# Altium schematic sheet 03-POWER.SchDoc
size A2; Customer: 01910; SPICEModelCache: <root> / <DocumentId>GNEMVTBT</DocumentId> / <CacheFrame Number="0"> / <Model Name="emk105bj105_v-f" Kind="CKT"> / <Text>* EMK105BJ105_V-F     SPICE MODEL  ( General Type ) / *-------------------------------------------------------------------------------------------------------- / * Model Generated by TAIYO YUDEN Corporation (http://www.ty-top.com) / * Version 1.0 / * TAIYO YUDEN Control No. 170508_130520 / * Copyright(c) 2012 TAIYO YUDEN CO.,LTD. All Rights Reserved. / *-------------------------------------------------------------------------------------------------------- / * / * Products Name : Multilayer Ceramic Capacitors / * / * Characteristics : / *     Capacitance : 1 uF , Rated Voltage : 16V , TCC : X5R / *     Case Size : 1.0 x 0.5 / 0.039 x 0.02 [mm/inch] , Thickness : 0.5 / 0.02 [mm/inch] / *     (Conditions: Temperature = 25 degC , DC Bias Current/Voltage = 0A / 0V) / * / * Frequency Range : 40Hz - 3GHz / * / * External Node Assignments : / * / *  1  o---| |---o  2 / * / *-------------------------------------------------------------------------------------------------------- / .SubCkt EMK105BJ105_V-F 1 2 / **************************** / C0 1 110 0.68309u / Cm 1 101 0.26053u / C1 101 102 0.94076u / Rc1 101 102 1.9029k / C2 102 103 0.66707u / Rc2 102 103 120.36 / C3 103 110 0.57203u / Rc3 103 110 2.1097 / C2m 1 301 0.1871u / C21 301 302 3.2494u / Rc21 301 302 1.1117k / C22 302 303 2.1014u / Rc22 302 303 1.484k / C23 303 304 2.1172u / Rc23 303 304 1.3876k / C24 304 305 0.75729u / Rc24 304 305 332.59 / C25 305 306 0.94401u / Rc25 305 306 249.09 / C26 306 307 0.34674u / Rc26 306 307 28.352 / C27 307 308 0.37158u / Rc27 307 308 19.989 / C28 308 309 0.17933u / Rc28 308 309 31.748 / C29 309 110 0.016445u / Rc29 309 110 1.0592 / Rp0 1 110 100Meg / L0 110 120 0.2216n / Lm 120 130 0.1509n / L1 120 121 0.12659n / RL1 121 130 0.85161 / L2 120 122 0.15996n / RL2 122 130 0.42469 / L3 120 123 7.9543n / RL3 123 130 0.54643m / CR 120 124 0.24334u / LR 124 125 0.090738n / RR 125 130 68.076m / CL 130 140 2.7354p / LL 130 140 0.10762n / RL 130 140 50.614 / Rs 140 2 7.5416m / **************************** / .ends EMK105BJ105_V-F</Text> / </Model> / </CacheFrame> / </root>
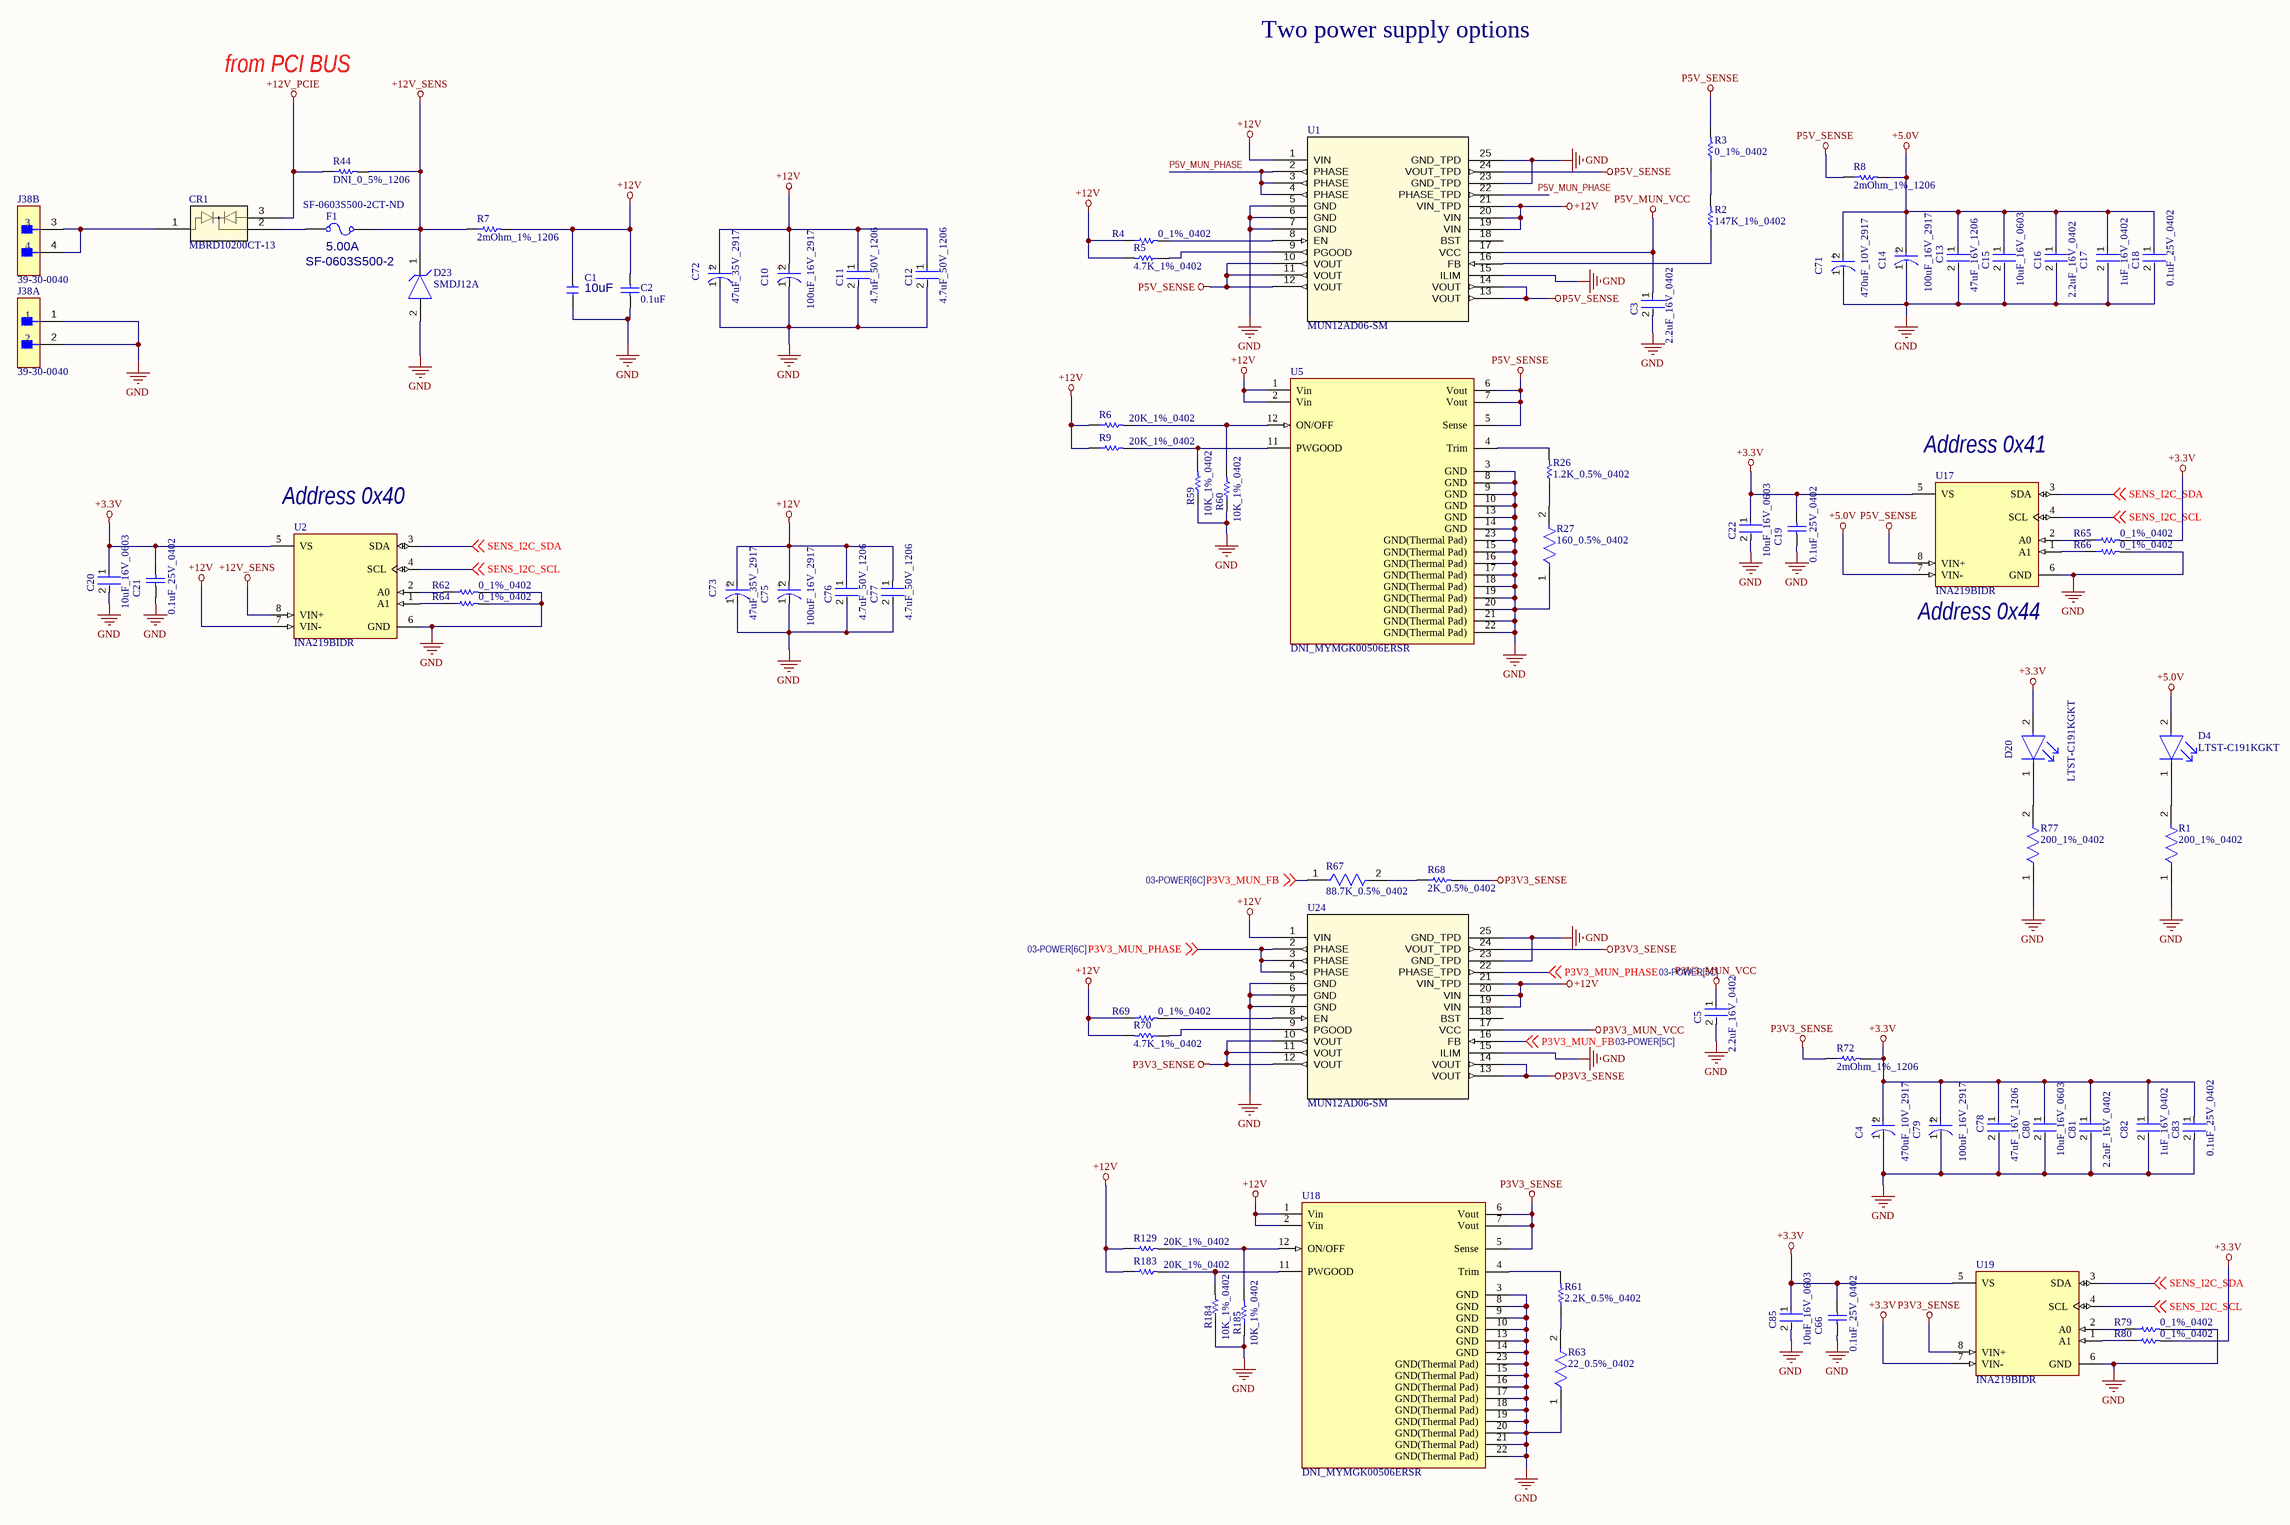
[diagram p0: 03-POWER.SchDoc]

## Parts
C1  value 10uF  [CAPC2012X14N]  (hidden comment: CAP_0805_10UF_25V)
C2  0.1uF  [CAPC1608X87X45ML20T05]
C3  2.2uF_16V_0402  [FP-C1005-050-0_05-IPC_A]
C4  470uF_10V_2917  [FP-TAJE-MFG]
C5  2.2uF_16V_0402  [FP-C1005-050-0_05-IPC_A]
C10  100uF_16V_2917  [FP-T495D107K016ATE125-MFG]
C11  4.7uF_50V_1206  [FP-GRM31C-0_2-e0_3_0_8-IPC_C]
C12  4.7uF_50V_1206  [FP-GRM31C-0_2-e0_3_0_8-IPC_C]
C13  47uF_16V_1206  [FP-C3216-160-0_2-MFG]
C14  100uF_16V_2917  [FP-T495D107K016ATE125-MFG]
C15  10uF_16V_0603  [FP-0603-L_1_6_0_2-W_0_8_0-MFG]
C16  2.2uF_16V_0402  [FP-C1005-050-0_05-IPC_A]
C17  1uF_16V_0402  [FP-0402-L_1_0_0_05-W_0_5-IPC_A]
C18  0.1uF_25V_0402  [FP-0402-L_1_0_1-W_0_5_0_1-IPC_C]
C19  0.1uF_25V_0402  [CAPC1005X56X25NL10T15]
C20  10uF_16V_0603  [FP-0603-L_1_6_0_2-W_0_8_0-MFG]
C21  0.1uF_25V_0402  [CAPC1005X56X25NL10T15]
C22  10uF_16V_0603  [FP-0603-L_1_6_0_2-W_0_8_0-MFG]
C66  0.1uF_25V_0402  [CAPC1005X56X25NL10T15]
C71  470uF_10V_2917  [FP-TAJE-MFG]
C72  47uF_35V_2917  [FP-T521X476M035ATE030-MFG]
C73  47uF_35V_2917  [FP-T521X476M035ATE030-MFG]
C75  100uF_16V_2917  [FP-T495D107K016ATE125-MFG]
C76  4.7uF_50V_1206  [FP-GRM31C-0_2-e0_3_0_8-IPC_C]
C77  4.7uF_50V_1206  [FP-GRM31C-0_2-e0_3_0_8-IPC_C]
C78  47uF_16V_1206  [FP-C3216-160-0_2-MFG]
C79  100uF_16V_2917  [FP-T495D107K016ATE125-MFG]
C80  10uF_16V_0603  [FP-0603-L_1_6_0_2-W_0_8_0-MFG]
C81  2.2uF_16V_0402  [FP-C1005-050-0_05-IPC_A]
C82  1uF_16V_0402  [FP-0402-L_1_0_0_05-W_0_5-IPC_A]
C83  0.1uF_25V_0402  [FP-0402-L_1_0_1-W_0_5_0_1-IPC_C]
C85  10uF_16V_0603  [FP-0603-L_1_6_0_2-W_0_8_0-MFG]
CR1  MBRD10200CT-13  [TO252(DPAK)_DIO]
D4  LTST-C191KGKT  [FP-LTST-C191KGKT-MFG]
D20  LTST-C191KGKT  [FP-LTST-C191KGKT-MFG]
D23  SMDJ12A  [FP-DO-214AB_SMC_J-Bend-MFG]
F1  value 5.00A  MFG PART NUM: SF-0603S500-2  Supplier Part Number 1: SF-0603S500-2CT-ND  [FUSM1608X60N]  (hidden comment: FUSE_0603_5.00A)
J38  39-30-0040  [FP-39-30-0040-MFG]  (parts A,B of 2)
R1  200_1%_0402  [FP-ERJ2RK-IPC_A]
R2  147K_1%_0402  [RESC1005X40X25ML05T10]
R3  0_1%_0402  [RESC1005X40X25LL05T05]
R4  0_1%_0402  [RESC1005X40X25LL05T05]
R5  4.7K_1%_0402  [RESC1005X40X25NL10T10]
R6  20K_1%_0402  [RESC1005X40X25NL10T10]
R7  2mOhm_1%_1206  [RESC3216X89X64NL25T25]
R8  2mOhm_1%_1206  [RESC3216X89X64NL25T25]
R9  20K_1%_0402  [RESC1005X40X25NL10T10]
R26  1.2K_0.5%_0402  [RESC1005X40X25ML10T10]
R27  160_0.5%_0402  [FP-RT0402-MFG]
R44  DNI_0_5%_1206  [RESC3116X65X50ML20T20]  (no BOM)
R59  10K_1%_0402  [RESC1005X40X25NL10T10]
R60  10K_1%_0402  [RESC1005X40X25NL10T10]
R61  2.2K_0.5%_0402  [RESC1005X40X25ML10T10]
R62  0_1%_0402  [RESC1005X40X25LL05T05]
R63  22_0.5%_0402  [FP-RG1005-IPC_A]
R64  0_1%_0402  [RESC1005X40X25LL05T05]
R65  0_1%_0402  [RESC1005X40X25LL05T05]
R66  0_1%_0402  [RESC1005X40X25LL05T05]
R67  88.7K_0.5%_0402  [FP-RT0402-MFG]
R68  2K_0.5%_0402  [RESC1005X35X25LL10T10]
R69  0_1%_0402  [RESC1005X40X25LL05T05]
R70  4.7K_1%_0402  [RESC1005X40X25NL10T10]
R72  2mOhm_1%_1206  [RESC3216X89X64NL25T25]
R77  200_1%_0402  [FP-ERJ2RK-IPC_A]
R79  0_1%_0402  [RESC1005X40X25LL05T05]
R80  0_1%_0402  [RESC1005X40X25LL05T05]
R129  20K_1%_0402  [RESC1005X40X25NL10T10]
R183  20K_1%_0402  [RESC1005X40X25NL10T10]
R184  10K_1%_0402  [RESC1005X40X25NL10T10]
R185  10K_1%_0402  [RESC1005X40X25NL10T10]
U1  MUN12AD06-SM  [MUN12AD06-SM_CYN]
U2  INA219BIDR  [FP-D0008A-MFG]
U5  DNI_MYMGK00506ERSR  [FP-MYMGK-12-MFG]  (no BOM)
U17  INA219BIDR  [FP-D0008A-MFG]
U18  DNI_MYMGK00506ERSR  [FP-MYMGK-12-MFG]  (no BOM)
U19  INA219BIDR  [FP-D0008A-MFG]
U24  MUN12AD06-SM  [MUN12AD06-SM_CYN]

## Nets
+3.3V: C4.2(A) C19.2 C20.1 C21.2 C22.1 C66.2 C78.1 C79.2(A) C80.1 C81.1 C82.1 C83.1 C85.1 D20.2(A) R65.2 R72.2 R80.2 U2.5(VS) U17.5(VS) U19.5(VS) U19.7(VIN-)
+5.0V: C13.1 C14.2(A) C15.1 C16.1 C17.1 C18.1 C71.2(A) D4.2(A) R8.2 U17.7(VIN-)
+12V: C1.1 C2.2 C10.2(A) C11.1 C12.1 C72.2(A) C73.2(A) C75.2(A) C76.1 C77.1 R4.1 R5.2 R6.1 R7.2 R9.1 R69.1 R70.2 R129.1 R183.1 U1.1(VIN) U1.19(VIN) U1.20(VIN) U1.21(VIN_TPD) U2.7(VIN-) U5.1(Vin) U5.2(Vin) U18.1(Vin) U18.2(Vin) U24.1(VIN) U24.19(VIN) U24.20(VIN) U24.21(VIN_TPD)
+12V_PCIE: CR1.3 R44.1
+12V_SENS: D23.1(C) F1.2 R7.1 R44.2 U2.8(VIN+)
GND: C1.2 C2.1 C3.2 C4.1(C) C5.2 C10.1(C) C11.2 C12.2 C13.2 C14.1(C) C15.2 C16.2 C17.2 C18.2 C19.1 C20.2 C21.1 C22.2 C66.1 C71.1(C) C72.1(C) C73.1(C) C75.1(C) C76.2 C77.2 C78.2 C79.1(C) C80.2 C81.2 C82.2 C83.2 C85.2 D23.2(A) J38.1 J38.2 R1.1 R27.1 R59.1 R60.1 R62.2 R63.1 R64.2 R66.2 R77.1 R79.2 R184.1 R185.1 U1.5(GND) U1.6(GND) U1.7(GND) U1.15(ILIM) U1.23(GND_TPD) U1.25(GND_TPD) U2.6(GND) U5.3(GND) U5.8(GND) U5.9(GND) U5.10(GND) U5.13(GND) U5.14(GND) U5.15(GND(Thermal_Pad)) U5.16(GND(Thermal_Pad)) U5.17(GND(Thermal_Pad)) U5.18(GND(Thermal_Pad)) U5.19(GND(Thermal_Pad)) U5.20(GND(Thermal_Pad)) U5.21(GND(Thermal_Pad)) U5.22(GND(Thermal_Pad)) U5.23(GND(Thermal_Pad)) U17.6(GND) U18.3(GND) U18.8(GND) U18.9(GND) U18.10(GND) U18.13(GND) U18.14(GND) U18.15(GND(Thermal_Pad)) U18.16(GND(Thermal_Pad)) U18.17(GND(Thermal_Pad)) U18.18(GND(Thermal_Pad)) U18.19(GND(Thermal_Pad)) U18.20(GND(Thermal_Pad)) U18.21(GND(Thermal_Pad)) U18.22(GND(Thermal_Pad)) U18.23(GND(Thermal_Pad)) U19.6(GND) U24.5(GND) U24.6(GND) U24.7(GND) U24.15(ILIM) U24.23(GND_TPD) U24.25(GND_TPD)
P3V3_MUN_VCC: C5.1 U24.17(VCC)
P3V3_SENSE: R68.2 R72.1 U18.5(Sense) U18.6(Vout) U18.7(Vout) U19.8(VIN+) U24.10(VOUT) U24.11(VOUT) U24.12(VOUT) U24.13(VOUT) U24.14(VOUT) U24.24(VOUT_TPD)
P5V_MUN_VCC: C3.1 U1.17(VCC)
P5V_SENSE: R3.2 R8.1 U1.10(VOUT) U1.11(VOUT) U1.12(VOUT) U1.13(VOUT) U1.14(VOUT) U1.24(VOUT_TPD) U5.5(Sense) U5.6(Vout) U5.7(Vout) U17.8(VIN+)
P3V3_MUN_FB: R67.1 U24.16(FB) ; off-sheet P3V3_MUN_FB
P3V3_MUN_PHASE: U24.2(PHASE) U24.3(PHASE) U24.4(PHASE) U24.22(PHASE_TPD) ; off-sheet P3V3_MUN_PHASE
P5V_MUN_PHASE: U1.2(PHASE) U1.3(PHASE) U1.4(PHASE) U1.22(PHASE_TPD)
SENS_I2C_SCL: U2.4(SCL) U17.4(SCL) U19.4(SCL) ; off-sheet SENS_I2C_SCL
SENS_I2C_SDA: U2.3(SDA) U17.3(SDA) U19.3(SDA) ; off-sheet SENS_I2C_SDA
NetCR1_1: CR1.1 J38.3 J38.4
NetCR1_2: CR1.2 F1.1
NetD4_1: D4.1(C) R1.2
NetD20_1: D20.1(C) R77.2
NetR2_1: R2.1 U1.16(FB)
NetR2_2: R2.2 R3.1
NetR4_2: R4.2 U1.8(EN)
NetR5_1: R5.1 U1.9(PGOOD)
NetR6_2: R6.2 R60.2 U5.12(ON/OFF)
NetR9_2: R9.2 R59.2 U5.11(PWGOOD)
NetR26_1: R26.1 R27.2
NetR26_2: R26.2 U5.4(Trim)
NetR61_1: R61.1 R63.2
NetR61_2: R61.2 U18.4(Trim)
NetR62_1: R62.1 U2.2(A0)
NetR64_1: R64.1 U2.1(A1)
NetR65_1: R65.1 U17.2(A0)
NetR66_1: R66.1 U17.1(A1)
NetR67_2: R67.2 R68.1
NetR69_2: R69.2 U24.8(EN)
NetR70_1: R70.1 U24.9(PGOOD)
NetR79_1: R79.1 U19.2(A0)
NetR80_1: R80.1 U19.1(A1)
NetR129_2: R129.2 R185.2 U18.12(ON/OFF)
NetR183_2: R183.2 R184.2 U18.11(PWGOOD)

Not connected (* = marked no-connect by the designer): U1 18(BST); U24 18(BST)

## Notes on the sheet
- Two power supply options
- from PCI BUS
- (near U2) Address 0x40
- (near U17) Address 0x41
- (near U17) Address 0x44
- SHEET
- REV
- timingcard.com <http://timingcard.com>
- DATE
- OF
- (in symbol CMP-2000-07207-2) +
- (in symbol CMP-03016-000019-1) +
- (in symbol CMP-04424-000243-1) +

## Library data of the parts
C1 = CAP_0805_10UF_25V: CAP, CER, 10.UF, 25V, 10%, X5R, 0805; MFG PART NUM: TMK212BBJ106KG-T; VALENTIUM PART NUM: <VALENTIUM>; MFG NAME: TAIYO YUDEN; MAXTEMP: 85C; MINTEMP: -55C; DESC: CAP, CER, 10.UF, 10V, 10%, X5R, 0805; MODIFY DATE: 10/23/2013; CATEGORY: CAP, CER; Date: 4/11/2006 3:37:28 PM; SHEETPART: *; P1: 10%; P2: 25V; P3: X5R; Size: 0805; Supplier 1: MOUSER; Supplier Part Number 1: 963-TMK212BBJ106KG-T
C2 = CMP-2006-00003-1: C0603X104K5RACAUTO; Manufacturer: Kemet; Part Number: C0603X104K5RACAUTO
C3 C5 C16 C81 = CMP-2000-05998-2: Multilayer Ceramic Capacitors 2.2μF ±10% 16V X5R SMD 0402; Capacitance: 2.2uF; REACH SVHC: No SVHC; Series: C; Termination: SMD/SMT; Case Code (Imperial): 0402; Depth: 0.5mm; Mount: Surface Mount; Width: 0.02inch; Package Quantity: 1; Dielectric Material: Ceramic; Length: 1mm; Packaging: Tape and Reel; Case Code (Metric): 1005; RoHS Compliant: Yes; Dielectric: X5R; Max Operating Temperature: 85°C; Lead Free: Lead Free; Weight: 2.3E-05oz; Thickness: 0.022inch; Voltage Rating (DC): 16V; Tolerance: 10%; Voltage Rating: 16V; Resistor Type: Ceramic; Height: 0.5mm; Case/Package: 0402; Min Operating Temperature: -55°C
C4 C71 = CMP-04424-000243-1: 470uF 10V  ±10% 500mΩ 2917  SMD Tantalum Capacitor; Leakage Current: 47uA; ESR (Equivalent Series Resistance): 500mR; Polarity: Polar; Construction: Flat; Width: 4.3mm; Mount: Surface Mount; Tolerance: 10%; Max Operating Temperature: 125°C; Min Operating Temperature: -55°C; Length: 7.3mm; Voltage: 10V; Dissipation Factor: 10%; REACH SVHC: No SVHC; Lead Free: Lead Free; Case/Package: 2917; Voltage Rating: 10V; Capacitance: 470uF; Series: TAJ; Height: 4.1mm; RoHS Compliant: Yes; Packaging: Tape and Reel; Voltage Rating (DC): 10V; Radiation Hardening: No; Dielectric Material: Tantalum; Number of Pins: 2; Depth: 4.3mm; Case Code (Metric): 7343; Case Code (Imperial): 2917; Termination: SMD/SMT; Lead Pitch: 4.4mm; Features: General Purpose; Height - Seated (Max): 0.169inch; Package Quantity: 1
C10 C14 C75 C79 = CMP-2000-07207-2: CAP TANT 100UF 10% 16V 2917; Life (Hours): 2000Hour; ESR (Equivalent Series Resistance): 125mR; Polarity: Polar; Dielectric Material: Tantalum; Dissipation Factor: 8%; Capacitance: 100uF; Radiation Hardening: No; RoHS Compliant: Yes; Length: 7.3mm; Features: General Purpose; Packaging: Tape and Reel; Package Quantity: 1; Weight: 0.023634oz; Voltage Rating: 16V; Width: 0.169inch; Case/Package: 2917; Mount: Surface Mount; Voltage: 16V; Min Operating Temperature: -55°C; Tolerance: 10%; REACH SVHC: No SVHC; Height - Seated (Max): 0.122inch; Number of Pins: 2; Construction: Flat; Depth: 4.3mm; Series: T495; Max Operating Temperature: 125°C; Failure Rate: 0.001%; Termination: SMD/SMT; Voltage Rating (DC): 16V; Case Code (Imperial): 2917; Case Code (Metric): 7343; Height: 2.8mm
C11 C12 C76 C77 = CMP-1037-04923-3: Chip Multilayer Ceramic Capacitors for General Purpose, 1206, 4.7uF, X7R, 15%, 10%, 50V; Height: 1.6mm; Voltage: 50V; Capacitance: 4.7uF; Lead Free: Lead Free; Max Operating Temperature: 125°C; Packaging: Tape and Reel; REACH SVHC: No SVHC; Voltage Rating: 50V; Mount: Surface Mount; Termination: SMD/SMT; Tolerance: 10%; Case/Package: 1206; Material: Ceramic; Depth: 1.6mm; Length: 3.2mm; Case Code (Metric): 3216; Voltage Rating (DC): 50V; Case Code (Imperial): 1206; Radiation Hardening: No; Width: 0.063inch; Thickness: 0.071inch; Package Quantity: 2000; Min Operating Temperature: -55°C; Dielectric: X7R
C13 C78 = CMP-2000-07442-2: Multilayer Ceramic Capacitors 47uF ±20% 16V X5R SMD 1206; Resistor Type: Ceramic; Width: 0.063inch; Case Code (Imperial): 1206; Radiation Hardening: No; Thickness: 0.071inch; Dielectric: X5R; Weight: 0.000571oz; Termination: SMD/SMT; Dielectric Material: Ceramic; Min Operating Temperature: -55°C; Depth: 1.6mm; Case Code (Metric): 3216; Max Operating Temperature: 85°C; RoHS Compliant: Yes; REACH SVHC: No SVHC; Mount: Surface Mount; Lead Free: Lead Free; Height: 1.6mm; Length: 3.2mm; Tolerance: 20%; Voltage Rating (DC): 16V; Capacitance: 47uF; Package Quantity: 1; Construction: Flat; Packaging: Tape and Reel; Series: C; Case/Package: 1206; Voltage Rating: 16V
C15 C20 C22 C80 C85 = CMP-2000-06226-4: Multilayer Ceramic Capacitor 10uF 16V X5R 20% SMD 0603 T/R; Packaging: Tape and Reel; Construction: Flat; Height: 0.8mm; Max Operating Temperature: 85°C; Dielectric: X5R; Case Code (Metric): 1608; Voltage Rating (DC): 16V; Width: 0.031inch; Voltage Rating: 16V; Length: 0.063inch; RoHS Compliant: Yes; Halogen Free: Halogen Free; Case Code (Imperial): 0603; Capacitance: 10uF; Mount: Surface Mount; Thickness: 0.031inch; Tolerance: 20%; Min Operating Temperature: -55°C; Series: M; Termination: SMD/SMT; Case/Package: 0603; Package Quantity: 1
C17 C82 = CMP-14477-000104-2: None; Tolerance: 10%; Voltage Rating: 16V; Dielectric: X5R; Capacitance: 1uF; Packaging: Tape and Reel; Depth: 0.5mm; Mount: Surface Mount; Thickness: 0.022inch; Package Quantity: 1; Min Operating Temperature: -55°C; Series: M; Voltage Rating (DC): 16V; Termination: SMD/SMT; Case/Package: 0402; Number of Pins: 2; Case Code (Imperial): 0402; Length: 1mm; Halogen Free: Halogen Free; Case Code (Metric): 1005; Width: 0.02inch; RoHS Compliant: Yes; Radiation Hardening: No; Max Operating Temperature: 85°C; Height: 0.5mm; Construction: Flat
C18 C83 = CMP-2008-02519-2: General Purpose Ceramic Capacitor, 0402, 100nF, 10%, X7R, 15%, 25V; Package Quantity: 1; Capacitance: 100nF; Min Operating Temperature: -55°C; Voltage: 25V; Voltage Rating: 25V; Construction: Flat; Max Operating Temperature: 125°C; Radiation Hardening: No; Depth: 0.5mm; Thickness: 0.022inch; Voltage Rating (DC): 25V; Number of Pins: 2; Lead Free: Lead Free; Series: -; REACH SVHC: No SVHC; Length: 1mm; Dielectric: X7R; RoHS Compliant: Yes; Mount: Surface Mount; Packaging: Tape and Reel; Case/Package: 0402; Case Code (Imperial): 0402; Termination: SMD/SMT; Width: 0.02inch; Case Code (Metric): 1005; Tolerance: 10%
C19 C21 C66 = CMP-1034-02072-2: Part Number: 04023D104KAT2A; Manufacturer: AVX Interconnect / Elco
C72 C73 = CMP-03016-000019-1: CAP TANT POLY 47UF 35V 2917; Tolerance: 20%; Dissipation Factor: 10%; Life (Hours): 2000Hour; Polarity: Polar; ESR (Equivalent Series Resistance): 30mR; Mount: Surface Mount; Voltage Rating (DC): 35V; Height - Seated (Max): 0.169inch; Package Quantity: 1; Height: 4mm; Max Operating Temperature: 125°C; Width: 4.3mm; Packaging: Tape and Reel; Case/Package: 2917; Series: KO-CAP T521; Min Operating Temperature: -55°C; Depth: 4.3mm; Case Code (Metric): 7343; Number of Pins: 2; RoHS Compliant: Yes; Case Code (Imperial): 2917; Capacitance: 47uF; REACH SVHC: No SVHC; Features: General Purpose; Termination: SMD/SMT; Length: 7.3mm; Voltage Rating: 35V; Construction: Flat
CR1 = MBRD10200CT-13: No Description Available; Mfr_Name: Diodes Inc; Type: Diodes - Rectifiers, Arrays; RefDes: RefDes
D4 D20 = CMP-2000-05198-2: LED GREEN CLEAR SMD; Max Power Dissipation: 75mW; Forward Current: 30mA; Reverse Voltage: 5V; Lens Color: Colorless; Forward Voltage: 2V; Dominant Wavelength: 571nm; Number of LEDs: 1; Viewing Angle: 130°; Lens Style: Rectangular; Test Current: 20mA; Luminous Intensity: 35mcd; Wavelength: 574nm; Width: 0.8mm; Case Code (Imperial): 0603; Number of Pins: 2; Lead Free: Lead Free; Packaging: Tape and Reel; Package Quantity: 1; Min Operating Temperature: -55°C; Case/Package: 0603; Length: 1.6mm; Power Dissipation: 75mW; Depth: 0.8mm; Radiation Hardening: No; Mount: Surface Mount; Max Operating Temperature: 85°C; Color: Green; Power Rating: 75mW; Height: 0.55mm; Illumination Color: Green; Case Code (Metric): 1608; Lens Transparency: Clear; Number of Elements: 1
D23 = CMP-08607-000111-1: TVS DIODE 12V 19.9V DO214AB; Number of Channels: 1; Power Line Protection: No; Reverse Breakdown Voltage: 13.3V; Max Power Dissipation: 6.5W; Peak Pulse Current: 150.8A; Leakage Current: 2uA; Diode Type: ZENER; Power Dissipation: 3kW; Test Current: 1mA; Direction: Unidirectional; Max Breakdown Voltage: 14.7V; Lead Free: Lead Free; Packaging: Tape and Reel; Series: SMDJ; Number of Pins: 2; Resistor Type: Zener; Termination: SMD/SMT; RoHS Compliant: Yes; Number of Elements: 1; REACH SVHC: No SVHC; Min Breakdown Voltage: 13.3V; Mount: Surface Mount; Operating Supply Voltage: 12V; Polarity: Unidirectional; Breakdown Voltage: 13.3V; Max Surge Current: 150.8A; Clamping Voltage-Max: 19.9V; Clamping Voltage: 19.9V; Reverse Standoff Voltage: 12V; Max Operating Temperature: 150°C; Case/Package: DO-214AB; Package Quantity: 3000; Peak Pulse Power: 3kW; Min Operating Temperature: -55°C; Number of Unidirectional Channels: 1
F1 = FUSE_0603_2.00A: FUSE SLOW 5.00A 32V M 0603; VALENTIUM PART NUM: <VALENTIUM>; MFG NAME: BOURNS; MAXTEMP: 105C; MINTEMP: -40C; OTHER: UL E141069; P1: SLOW BLO; DESC: FUSE SLOW 1.25A 32V M 0603; MODIFY DATE: 9/4/2013; CATEGORY: FUSE; DATE: 20 OCT 15; P2: 32V; P3: M; SIZE: 0603; SHEETPART: *; Supplier 1: Digi-Key
J38 = CMP-2000-05600-2: CONN HEADER R/A 4POS 4.2MM; Manufacturer: Molex; Current Rating: 13A; Voltage Rating: 600V; Number Of Contacts: 4; Standoff Height: 0.4mm; Conn Orientation: Right Angle; Conn Gender: Male; Device Class L1: Connectors; Pitch: 4.2mm; Package: 39-30-0040; Octopart: https://octopart.com/39-30-0040-molex-277428; Mouser Description: Headers & Wire Housings 4 CKT R/A HEADER; Temperature Range High: +105°C; Number Of Rows: 2; ComponentLink2Description: Datasheet; ComponentLink2URL: https://www.molex.com/webdocs/datasheets/pdf/en-us/0039300040_PCB_HEADERS.pdf; Manufacturer Part Number: 39-30-0040; Contact Material: Gold,Nickel; Digikey Description: CONN HEADER R/A 4POS 4.2MM; Temperature: -40°C to +105°C; Automotive: No; Device Class L2: Headers and Wire Housings; RoHS: TRUE; Lead Free: Yes; Device Class L3: unset; Category: Conn; Footprint Url: https://www.molex.com/pdm_docs/sd/039300040_sd.pdf; Temperature Range Low: -40°C
R1 R77 = CMP-2002-00757-2: RES SMD 200 OHM 1% 1/10W 0402; Power Rating: 100mW; Voltage Rating (DC): 50V; Resistance: 200R; Temperature Coefficient: 100ppm/°C; RoHS Compliant: Yes; Packaging: Tape and Reel; Case Code (Metric): 1005; Package Quantity: 1; Contact Plating: Tin; Series: ERJ; Mount: Surface Mount; Lead Free: Lead Free; Min Operating Temperature: -55°C; Number of Terminations: 2; Max Power Dissipation: 100mW; Technology: THICK FILM; Voltage Rating: 50V; Case/Package: 0402; Width: 0.02inch; Termination: SMD/SMT; Military Standard: Not; Height: 0.35mm; Radiation Hardening: No; Resistance Tolerance: 1%; Length: 1mm; REACH SVHC: No SVHC; Construction: Rectangular; Depth: 0.5mm; Features: Automotive AEC-Q200; Resistor Type: Thick Film; Case Code (Imperial): 0402; Tolerance: 1%; Size Code: 0402; Max Operating Temperature: 155°C
R2 = CMP-2002-07394-1: Manufacturer: Yageo / Phycomp; Part Number: RC0402FR-07147KL
R3 R4 R62 R64-R66 R69 R79 R80 = CMP-2000-07451-1: Chip Resistor, 0 Ohm, 0.1 W, -55 to 155 degC, 0402 (1005 Metric), RoHS, Tape and Reel; Manufacturer: Panasonic; Voltage Rating (DC): 50V; Temperature Coefficient: 600ppm/��C; Max Power Dissipation: 100mW; Resistance: 0mOhm; Tolerance: 5%; Number of Terminations: 2; Mount: SurfaceMount; Height: 0.35mm; Packaging: TapeandReel; Contact Plating: Tin; Manufacturer URL: http://www.panasonic.com/; Composition: ThickFilm; Max Operating Temperature: 155degC; REACH SVHC: NoSVHC; Case/Package: 0402; Package Reference: 402; Depth: 0.5mm; Package Description: 2-Pin Surface Mount Device, Body 1 x 0.5 mm; Datasheet URL: https://industrial.panasonic.com/cdbs/www-data/pdf/RDA0000/AOA0000C301.pdf; RoHSCompliant: True; Case Code (Imperial): 0402; Military Standard: Not; Min Operating Temperature: -55degC; Power Rating: 100mW; Datasheet Version: 03/2015; Length: 1mm; Case Code (Metric): 1005; Termination: SMD/SMT; Mounting Technology: SurfaceMount; Voltage Rating: 50V; Width: 0.02inch; Package Quantity: 1; Lead Free: LeadFree; Radiation Hardening: No
R5 R70 = CMP-2002-05217-1: Manufacturer: Bourns; Part Number: CR0402-FX-4701GLF
R6 R9 R129 R183 = CMP-2002-06039-1: Part Number: MC00625W0402120K; Manufacturer: Multicomp
R7 R8 R72 = CMP-2003-04334-1: Manufacturer: Vishay Dale; Part Number: WSL12062L000FEA18
R26 = CMP-2002-05839-1: Part Number: ERA-2AED122X; Manufacturer: Panasonic
R27 = CMP-03412-035461-1: RES SMD 160 OHM 0.5% 1/16W 0402; Manufacturer Part Number: RT0402DRE07160RL; Manufacturer: Yageo; Tolerance: 0.005; Value: 160Ω; Voltage Rating: 50V; Temperature Coefficient: 50 ppm/°C; Power Rating: 0.063W; Device Class L1: Passive Components; Device Class L2: Resistors; Device Class L3: Chip SMD Resistors; Package: RT0402; Height: 0.35mm; Octopart: https://octopart.com/rt0402dre07160rl-yageo-1216058; Temperature Range High: +155°C; ComponentLink2URL: http://www.yageo.com/documents/recent/PYu-RT_1-to-0.01_RoHS_L_9.pdf; Temperature Range Low: -55°C; Temperature: -55°C to +155°C; Ipc Land Pattern Name: RESC10050X30; Footprint Url: http://www.yageo.com/exep/pages/download/literatures/PYu-R_Mount_10.pdf; Series: RT; Composition: Thin Film; Automotive: No; Resistance: 160Ω; ComponentLink2Description: Datasheet; Category: Res; Lead Free: Yes; Digikey Description: RES SMD 160 OHM 0.5% 1/16W 0402; RoHS: TRUE
R44 = CMP-2003-04873-1: Part Number: CRCW12060000Z0EAHP; Manufacturer: Vishay Dale
R59 R60 R184 R185 = CMP-2002-04694-1: Manufacturer: Bourns; Part Number: CR0402-FX-1002GLF
R61 = CMP-2002-05848-1: Part Number: ERA-2AED222X; Manufacturer: Panasonic
R63 = CMP-2002-01415-2: Automotive Metal Thin Film Chip Resistor, 0402, 22Ω, 0.5%, 100ppm/°C, 0.0625W, 75V; Voltage Rating (DC): 25V; Max Power Dissipation: 63mW; Resistance: 22R; Temperature Coefficient: 100ppm/°C; RoHS Compliant: Yes; Voltage Rating: 75V; Height: 0.016inch; Lead Free: Lead Free; Packaging: Tape and Reel; Termination: SMD/SMT; Length: 0.039inch; Package Quantity: 1; Weight: 2.3E-05oz; Case/Package: 0402; Power Rating: 63mW; Case Code (Metric): 1005; Max Operating Temperature: 155°C; Series: RG; Width: 0.02inch; Number of Terminations: 2; Features: Automotive AEC-Q200; Min Operating Temperature: -55°C; Case Code (Imperial): 0402; Tolerance: 0.5%; Resistor Type: Thin Film
R67 = CMP-2002-03021-2: RES SMD 88.7K OHM 0.5% 1/16W; Manufacturer: Yageo; Manufacturer Part Number: RT0402DRE0788K7L; Voltage Rating: 50V; Power Rating: 0.063W; Value: 88.7KΩ; Temperature Coefficient: 50 ppm/°C; Tolerance: 0.005; Temperature Range High: +155°C; Composition: Thin Film; ComponentLink2Description: Datasheet; RoHS: TRUE; Category: Res; Ipc Land Pattern Name: RESC10050X30; Octopart: https://octopart.com/rt0402dre0788k7l-yageo-1439224; ComponentLink2URL: http://www.yageo.com/documents/recent/PYu-RT_1-to-0.01_RoHS_L_9.pdf; Digikey Description: RES SMD 88.7K OHM 0.5% 1/16W; Height: 0.35mm; Series: RT; Footprint Url: http://www.yageo.com/exep/pages/download/literatures/PYu-R_Mount_10.pdf; Device Class L2: Resistors; Temperature: -55°C to +155°C; Temperature Range Low: -55°C; Package: RT0402; Device Class L1: Passive Components; Automotive: No; Lead Free: Yes; Device Class L3: Chip SMD Resistors; Resistance: 88.7KΩ
R68 = CMP-2002-02670-1: Part Number: RT0402DRD072KL; Manufacturer: Yageo
U1 U24 = MUN12AD06-SM: No Description Available; Mfr_Name: Cyntec; RefDes: RefDes; Type: Type
U2 U17 U19 = CMP-0704-00005-3: IC MONITOR PWR/CURR BIDIR 8-SOIC; Min Supply Voltage: 3V; Common Mode Rejection Ratio: 100dB; Output Current: 10mA; Number of Amplifiers: 1; Accuracy: 0.5%; Supply Current: 1mA; Quiescent Current: 700uA; Bandwidth: 11kHz; Input Offset Voltage (Vos): 40uV; Max Supply Voltage: 5.5V; Packaging: Tape and Reel; REACH SVHC: No SVHC; Max Operating Temperature: 125°C; Number of Pins: 8; Lead Free: Lead Free; Package Quantity: 1; Radiation Hardening: No; Case/Package: SOIC; Min Operating Temperature: -40°C; Contact Plating: Gold; Series: Zero-Drift; Nominal Supply Current: 1mA; RoHS Compliant: Yes
U5 U18 = CMP-20596-000049-1: DC DC CONVERTER 0.7-5V; Number of Outputs: 1; Max Output Current: 6A; Efficiency: 95%; Max Input Voltage: 14V; Voltage - Output 1: 5V; Min Input Voltage: 8V; Case/Package: SMD/SMT; Mount: Surface Mount; RoHS Compliant: Yes; Packaging: Tape and Reel; Min Operating Temperature: -40°C; Features: UVLO; Max Operating Temperature: 85°C